# EAGLE design QFN-20 0.5mm (EAGLE 8.0.2)
CNAME: QFN-20 0,5mm Breakout; CREVISION: V1.0; DESIGNER: November Five
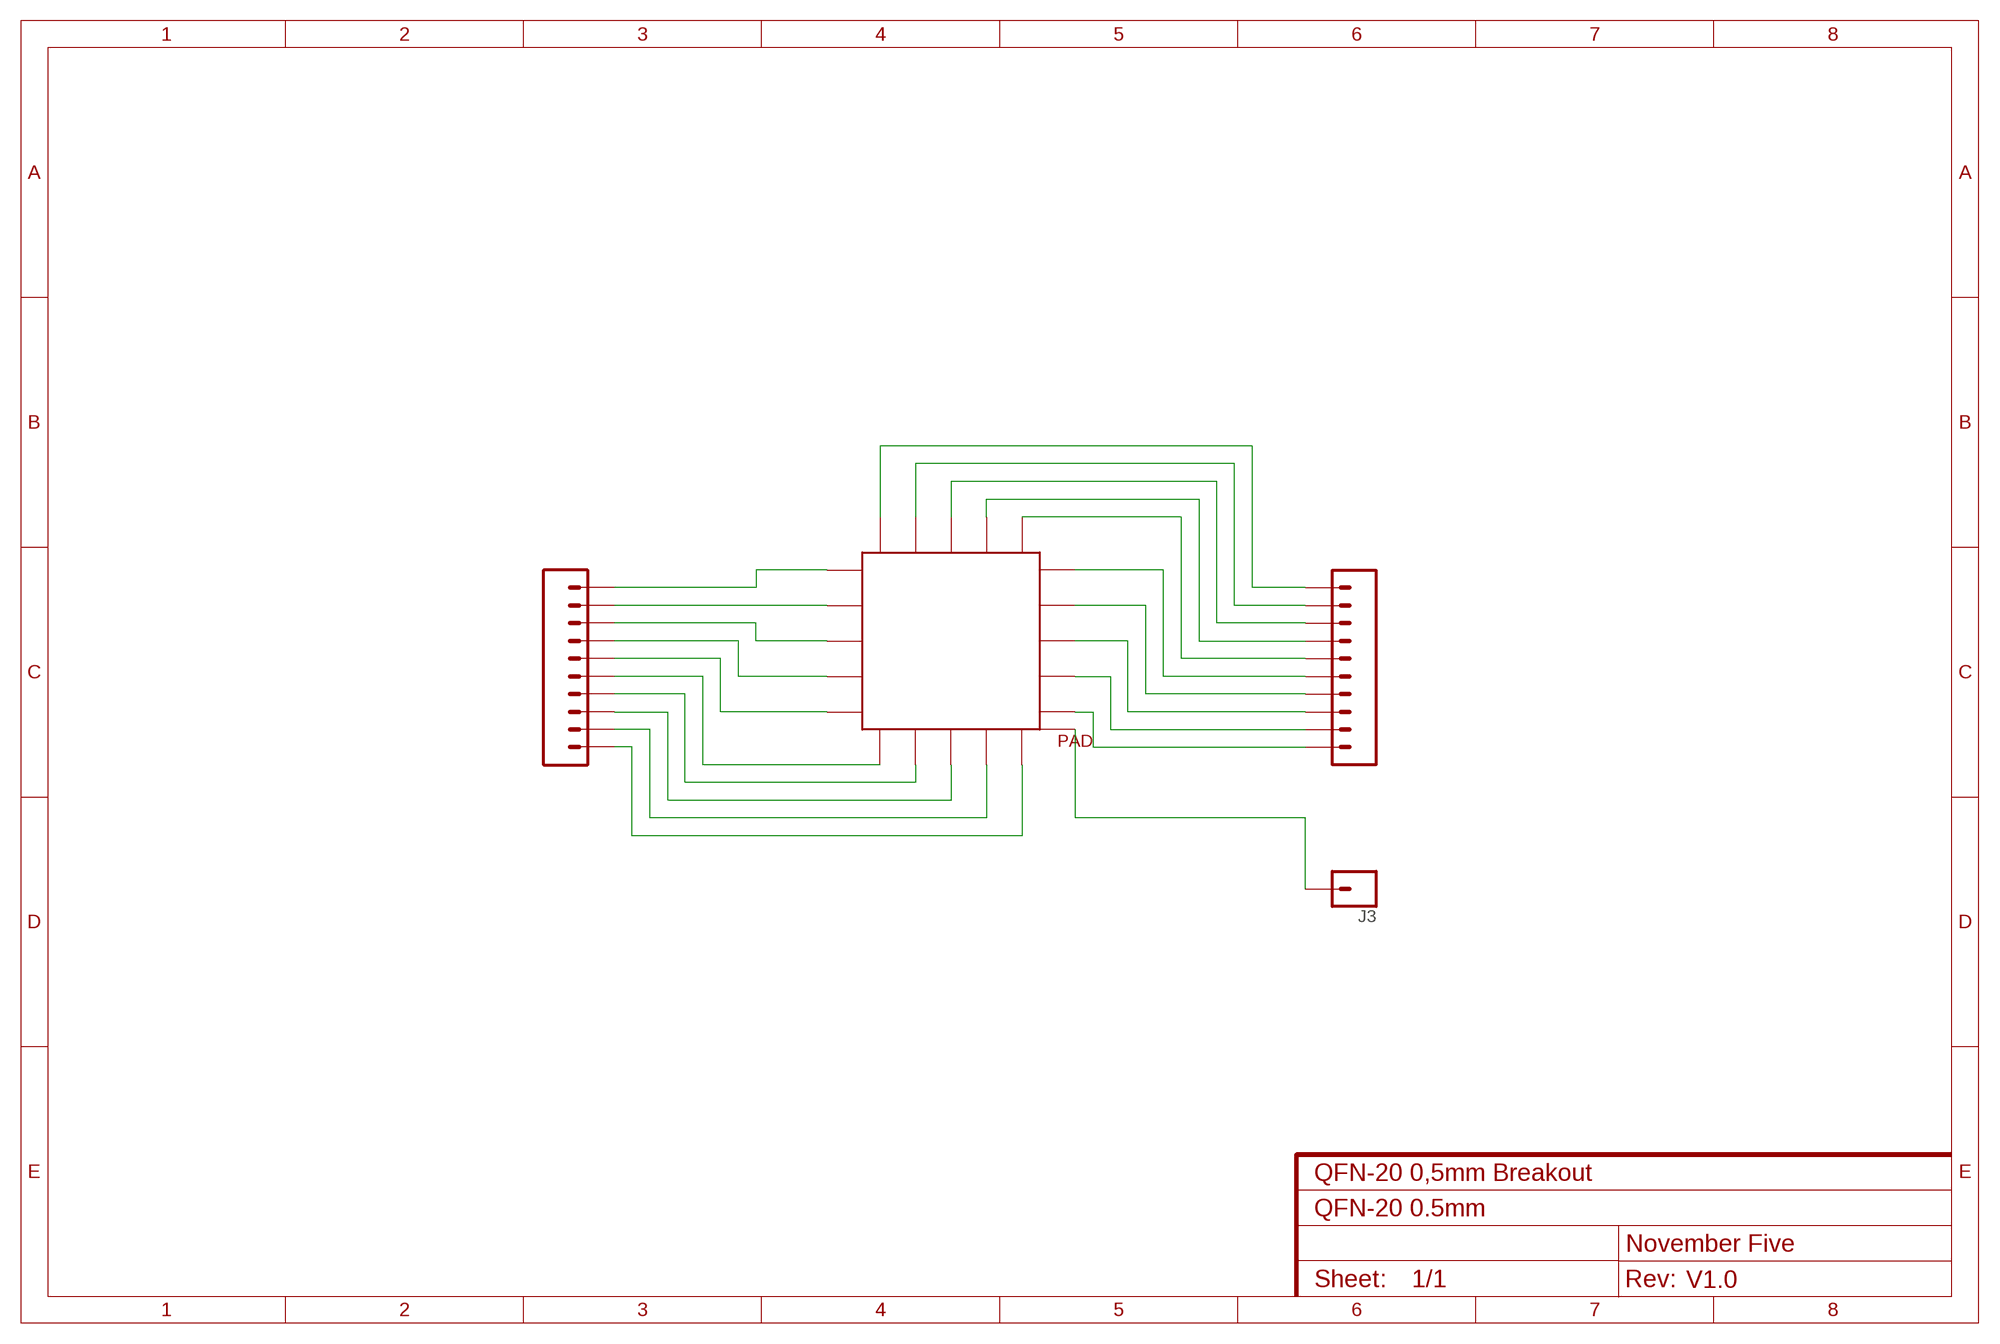
[diagram p0: schematic, sheet 1]

## Parts
J1  CONN_10"  [1X10]
J2  CONN_10"  [1X10]
J3  CONN_01  [1X01]
U$1  QFN-20_0,5MM  [QFN20_0,5MM]

## Nets
N$1: J1.1 U$1.1(PIN1)
N$2: J1.2 U$1.2(PIN2)
N$3: J1.3 U$1.3(PIN3)
N$4: J1.4 U$1.4(PIN4)
N$5: J1.5 U$1.5(PIN5)
N$6: J1.6 U$1.6(PIN6)
N$7: J1.7 U$1.7(PIN7)
N$8: J1.8 U$1.8(PIN8)
N$9: J1.9 U$1.9(PIN9)
N$10: J1.10 U$1.10(PIN10)
N$11: J3.1 U$1.0(PAD)
N$12: J2.10 U$1.11(PIN11)
N$13: J2.9 U$1.12(PIN12)
N$14: J2.8 U$1.13(PIN13)
N$15: J2.7 U$1.14(PIN14)
N$16: J2.6 U$1.15(PIN15)
N$17: J2.5 U$1.16(PIN16)
N$18: J2.4 U$1.17(PIN17)
N$19: J2.3 U$1.18(PIN18)
N$20: J2.2 U$1.19(PIN19)
N$21: J2.1 U$1.20(PIN20)

## Library data of the parts
J1 J2 = SparkFun-Connectors:CONN_10: Multi connection point. Often used as Generic Header-pin footprint for 0.1 inch spaced/style header connections On any of the 0.1 inch spaced packages, you can populate with these: Break Away Headers - Straight <https://www.sparkfun.com/products/116> (PRT-00116) Break Away Male Headers - Right Angle <https://www.sparkfun.com/products/553> (PRT-00553) Female Headers <https://www.sparkfun.com/products/115> (PRT-00115) Break Away Headers - Machine Pin <https://www.sparkfun.com/products/117> (PRT-00117) Break Away Female Headers - Swiss Machine Pin <https://www.sparkfun.com/products/743> (PRT-00743) Arduino Stackable Header - 10 Pin <https://www.sparkfun.com/products/11376> (PRT-11376) For SCREWTERMINALS and SPRING TERMINALS visit here: Screw Terimnals on SparkFun.com <https://www.sparkfun.com/search/results?term=Screw+Terminals> (5mm/3.5mm/2.54mm spacing) This device is also useful as a general connection point to wire up your design to another part of your project. Our various solder wires solder well into these plated through hole pads. Hook-Up Wire - Assortment (Stranded, 22 AWG) <https://www.sparkfun.com/products/11375> (PRT-11375) Hook-Up Wire - Assortment (Solid Core, 22 AWG) <https://www.sparkfun.com/products/11367> (PRT-11367) View the entire wire category on our website here <https://www.sparkfun.com/categories/141> Special notes: Molex polarized connector foot print use with SKU : PRT-08231 with associated crimp pins and housings. 1MM SMD Version SKU: PRT-10208 NOTES ON THE VARIANTS LOCK and LOCK_LONGPADS... This footprint was designed to help hold the alignment of a through-hole component (i.e. 6-pin header) while soldering it into place. You may notice that each hole has been shifted either up or down by 0.005 of an inch from it's more standard position (which is a perfectly straight line). This slight alteration caused the pins (the squares in the middle) to touch the edges of the holes. Because they are alternating, it causes a "brace" to hold the component in place. 0.005 has proven to be the perfect amount of "off-center" position when using our standard breakaway headers. Although looks a little odd when you look at the bare footprint, once you have a header in there, the alteration is very hard to notice. Also,if you push a header all the way into place, it is covered up entirely on the bottom side.; PROD_ID: CONN-11563
J3 = SparkFun-Connectors:CONN_01: Single connection point. Often used as Generic Header-pin footprint for 0.1 inch spaced/style header connections On any of the 0.1 inch spaced packages, you can populate with these: Break Away Headers - Straight <https://www.sparkfun.com/products/116> (PRT-00116) Break Away Male Headers - Right Angle <https://www.sparkfun.com/products/553> (PRT-00553) Female Headers <https://www.sparkfun.com/products/115> (PRT-00115) Break Away Headers - Machine Pin <https://www.sparkfun.com/products/117> (PRT-00117) Break Away Female Headers - Swiss Machine Pin <https://www.sparkfun.com/products/743> (PRT-00743) This device is also useful as a general connection point to wire up your design to another part of your project. Our various solder wires solder well into these plated through hole pads. Hook-Up Wire - Assortment (Stranded, 22 AWG) <https://www.sparkfun.com/products/11375> (PRT-11375) Hook-Up Wire - Assortment (Solid Core, 22 AWG) <https://www.sparkfun.com/products/11367> (PRT-11367) View the entire wire category on our website here <https://www.sparkfun.com/categories/141> Special notes: SMTSO-256-ET is a "flush mount" nut for a 4-40 screw. We mostly use this on specialty testbeds; it is a nice way to connect hardware to your PCB at an adjustable hieght. Also note, the SNAP packages are for using a snappable style connector. We sell a baggie of snaps and they are also used on two LilyPad designs: Snap Assortment - 30 pack (male and female) <https://www.sparkfun.com/products/11347> (DEV-11347) LilyPad Arduino SimpleSnap <https://www.sparkfun.com/products/10941> (DEV-10941) LilyPad SimpleSnap Protoboard <https://www.sparkfun.com/products/10940> (DEV-10940)
U$1 = smd-footprints:QFN-20_0,5MM

## Board
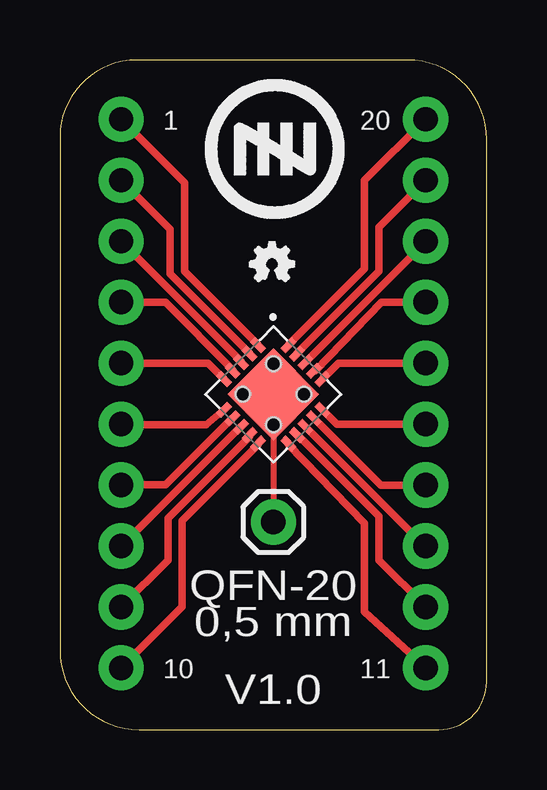
[diagram p1: board, top side]
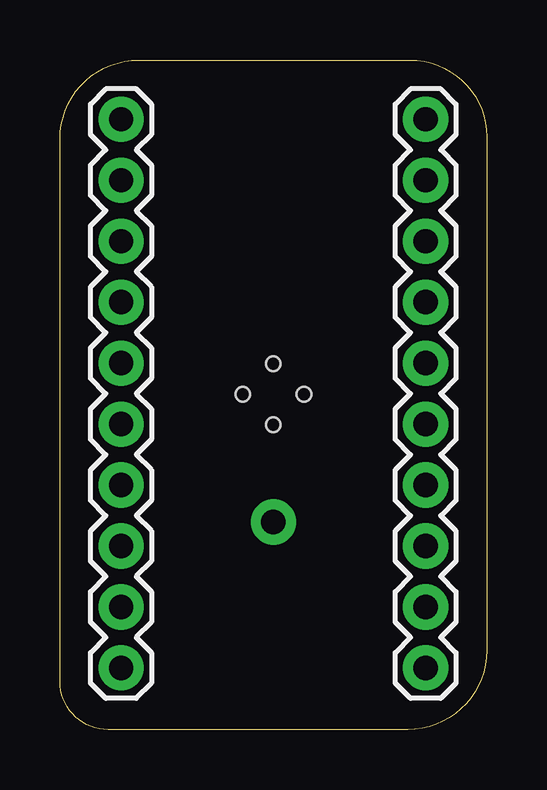
[diagram p2: board, bottom side, seen from below]

Size 17.8 x 27.9 mm. Coordinates in mm from the lower left corner, seen from the top.
Outline: 3.2,27.9 arc90 0,24.7 0,3.3 arc90 3.3,0 15.8,0 arc90 17.8,2 17.8,24.6 arc90 14.5,27.9 3.2,27.9
Copper layers (1*16): Top 0.035mm / dielectric 1.5mm / Bottom 0.035mm
Design rules "default": minimum track width 10mil, minimum drill 24mil, track to track 8mil, track to pad 8mil, pad to pad 8mil, via to via 8mil, smd to smd 8mil, copper to edge 40mil, drill to drill 8mil, minimum pad ring 10mil, minimum via ring 8mil, stop-mask expansion 4mil, vias tented up to drill 0mil, thermal gap 10mil

### Footprints (pad centres in the part's own frame; a part is rotated, then mirrored left to right if it is on the bottom)
1X10 = drill 1.016 pad 1.88: 1 0,0; 2 2.54,0; 3 5.08,0; 4 7.62,0; 5 10.16,0; 6 12.7,0; 7 15.24,0; 8 17.78,0; 9 20.32,0; 10 22.86,0
1X01 = drill 1.016 pad 1.88: 1 0,0
QFN20_0,5MM = smd 2.7 x 2.7: 0 0,0 | smd 0.65 x 0.3: 1 -1.9,1; 2 -1.9,0.5; 3 -1.9,0; 4 -1.9,-0.5; 5 -1.9,-1; 11 1.9,-1; 12 1.9,-0.5; 13 1.9,0; 14 1.9,0.5; 15 1.9,1 | smd 0.3 x 0.65: 6 -1,-1.9; 7 -0.5,-1.9; 8 0,-1.9; 9 0.5,-1.9; 10 1,-1.9; 16 1,1.9; 17 0.5,1.9; 18 0,1.9; 19 -0.5,1.9; 20 -1,1.9 | hole 0.6: -0.9,0.9; 0.9,0.9; -0.9,-0.9; 0.9,-0.9

### Placement (x,y rotation side)
J1  2.55,25.43 270 bottom
J2  15.25,25.43 270 bottom
J3  8.9,8.65 0 top
U$1  8.9,13.97 315 top
U$2  [LOGO-NOVEMERFIVE-7SCALE]  7,21.3 0 bottom
U$3  [LOGO-OSHWA]  7.65,18.6 0 top

### Tracks (layer width: path | path; a pad name or v marks a point on that pad's centre or on a via)
N$1
  Top 0.305: U$1.1 8.26,16.04 5.2,19.1 5.2,22.78 J1.1
N$2
  Top 0.305: U$1.2 7.91,15.69 4.6,19 4.6,20.84 J1.2
N$3
  Top 0.305: U$1.3 7.56,15.34 J1.3
N$4
  Top 0.305: U$1.4 7.2,15 4.4,17.8 J1.4
N$5
  Top 0.305: J1.5 6.19,15.27 U$1.5
N$6
  Top 0.305: U$1.6 6.83,13.33 6.1,12.7 2.68,12.7 J1.6
N$7
  Top 0.305: U$1.7 7.18,12.98 4.4,10.2 J1.7
N$8
  Top 0.305: U$1.8 7.53,12.63 J1.8
N$9
  Top 0.305: U$1.9 7.91,12.21 4.5,8.8 4.5,7.06 J1.9
N$10
  Top 0.305: U$1.10 8.26,11.86 5.1,8.7 5.1,5.12 J1.10
N$11
  Top 0.25: U$1.0 J3.1
N$12
  Top 0.305: U$1.11 9.54,11.86 12.7,8.6 12.7,4.92 J2.10
N$13
  Top 0.305: U$1.12 9.93,12.27 13.3,8.9 13.3,7.06 J2.9
N$14
  Top 0.305: J2.8 15.22,7.65 U$1.13
N$15
  Top 0.305: J2.7 13.39,10.19 U$1.14
N$16
  Top 0.305: J2.6 11.55,12.73 U$1.15
N$17
  Top 0.305: J2.5 11.61,15.27 U$1.16
N$18
  Top 0.305: U$1.17 10.66,14.96 13.4,17.8 15.14,17.8 J2.4
N$19
  Top 0.305: J2.3 15.25,20.32 U$1.18
N$20
  Top 0.305: U$1.19 9.89,15.69 13.3,19.1 13.3,20.94 J2.2
N$21
  Top 0.305: U$1.20 9.54,16.04 12.7,19.2 12.7,22.88 J2.1

### Text on the board
tPlace: 1 | 20 | QFN-20 | 0,5 mm | 10 | 11 | V1.0